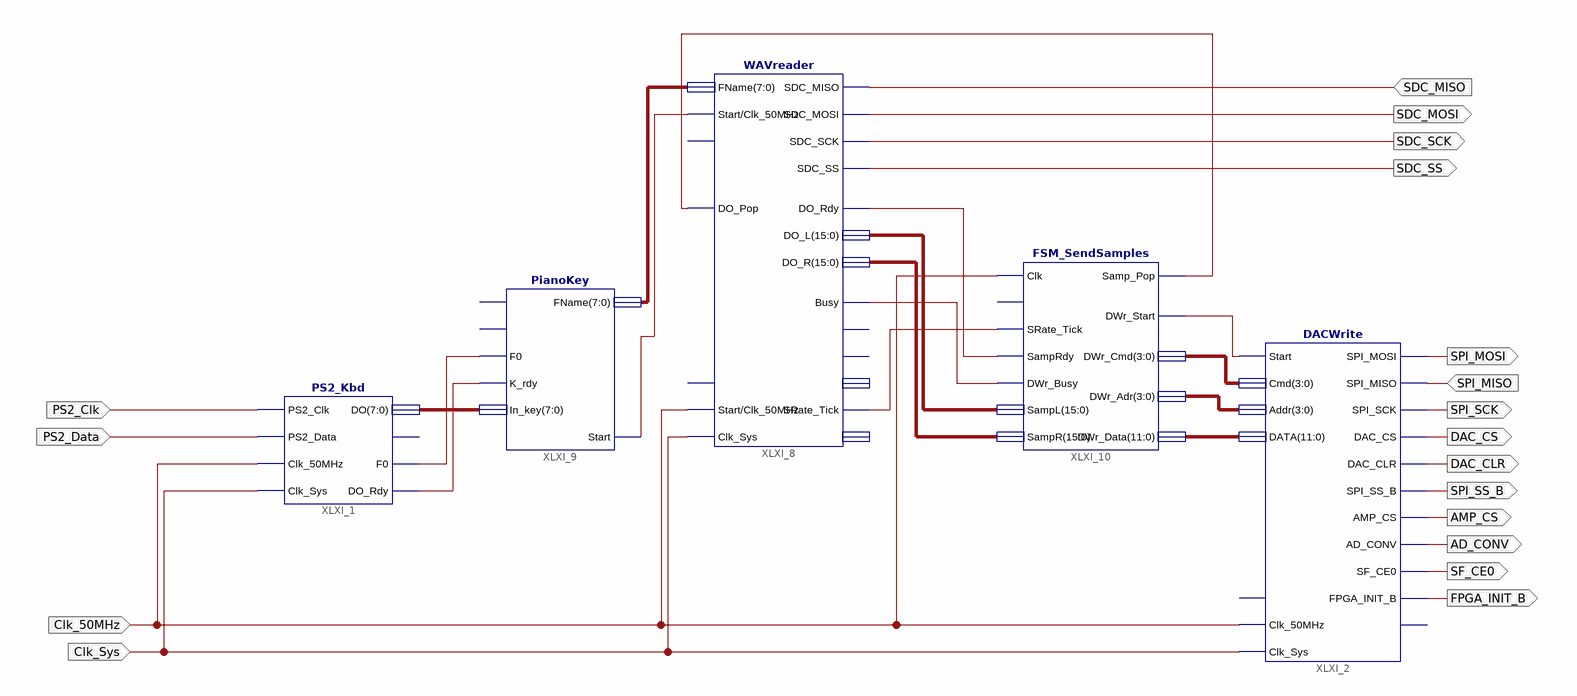
[diagram p0: schematic sheet 1]
// Xilinx ISE schematic PianoProject.sch (spartan3e) as structural Verilog: 5 symbols, 18 ports
module PianoProject (
  input  Clk_Sys,
  input  PS2_Clk,
  input  PS2_Data,
  input  SDC_MISO,
  input  SPI_MISO,
  input  Clk_50MHz,
  output SDC_MOSI,
  output SDC_SCK,
  output SDC_SS,
  output DAC_CLR,
  output DAC_CS,
  output SPI_SCK,
  output SPI_SS_B,
  output AMP_CS,
  output AD_CONV,
  output SF_CE0,
  output FPGA_INIT_B,
  output SPI_MOSI
);

  wire XLXN_146, XLXN_147, XLXN_159, XLXN_164, XLXN_167, XLXN_168, XLXN_169;
  wire [3:0] XLXN_160, XLXN_161;
  wire [7:0] XLXN_145, XLXN_148;
  wire [11:0] XLXN_162;
  wire [15:0] XLXN_165, XLXN_166;

  PS2_Kbd XLXI_1 (
    .PS2_Clk(PS2_Clk), .PS2_Data(PS2_Data), .Clk_50MHz(Clk_50MHz), .F0(XLXN_146), .DO_Rdy(XLXN_147),
    .DO(XLXN_148), .Clk_Sys(Clk_Sys));  // open: E0
  PianoKey XLXI_9 (
    .F0(XLXN_146), .K_rdy(XLXN_147), .In_key(XLXN_148), .FName(XLXN_145), .Start(Clk_50MHz));  // open: Clr, Clk
  WAVreader XLXI_8 (
    .FName(XLXN_145), .Start(Clk_50MHz), .SDC_MOSI(SDC_MOSI), .SDC_SCK(SDC_SCK), .SDC_SS(SDC_SS),
    .SDC_MISO(SDC_MISO), .DO_Rdy(XLXN_167), .DO_L(XLXN_165), .DO_R(XLXN_166), .DO_Pop(XLXN_169),
    .Busy(XLXN_164), .SRate_Tick(XLXN_168), .Clk_50MHz(Clk_50MHz), .Clk_Sys(Clk_Sys));  // open: Abort, FmtMnS, Fmt8n16, FmtSRate, Error, Reset
  FSM_SendSamples XLXI_10 (
    .Clk(Clk_50MHz), .SRate_Tick(XLXN_168), .SampRdy(XLXN_167), .DWr_Busy(XLXN_164), .SampL(XLXN_165),
    .SampR(XLXN_166), .Samp_Pop(XLXN_169), .DWr_Start(XLXN_159), .DWr_Cmd(XLXN_160), .DWr_Adr(XLXN_161),
    .DWr_Data(XLXN_162));  // open: Reset
  DACWrite XLXI_2 (
    .Start(XLXN_159), .SPI_MISO(SPI_MISO), .Cmd(XLXN_160), .Addr(XLXN_161), .DATA(XLXN_162),
    .DAC_CLR(DAC_CLR), .DAC_CS(DAC_CS), .SPI_MOSI(SPI_MOSI), .SPI_SCK(SPI_SCK), .SPI_SS_B(SPI_SS_B),
    .AMP_CS(AMP_CS), .AD_CONV(AD_CONV), .SF_CE0(SF_CE0), .FPGA_INIT_B(FPGA_INIT_B), .Clk_50MHz(Clk_50MHz),
    .Clk_Sys(Clk_Sys));  // open: Reset, Busy
endmodule
